# EAGLE schematic System Diagram (EAGLE 8.3.2)
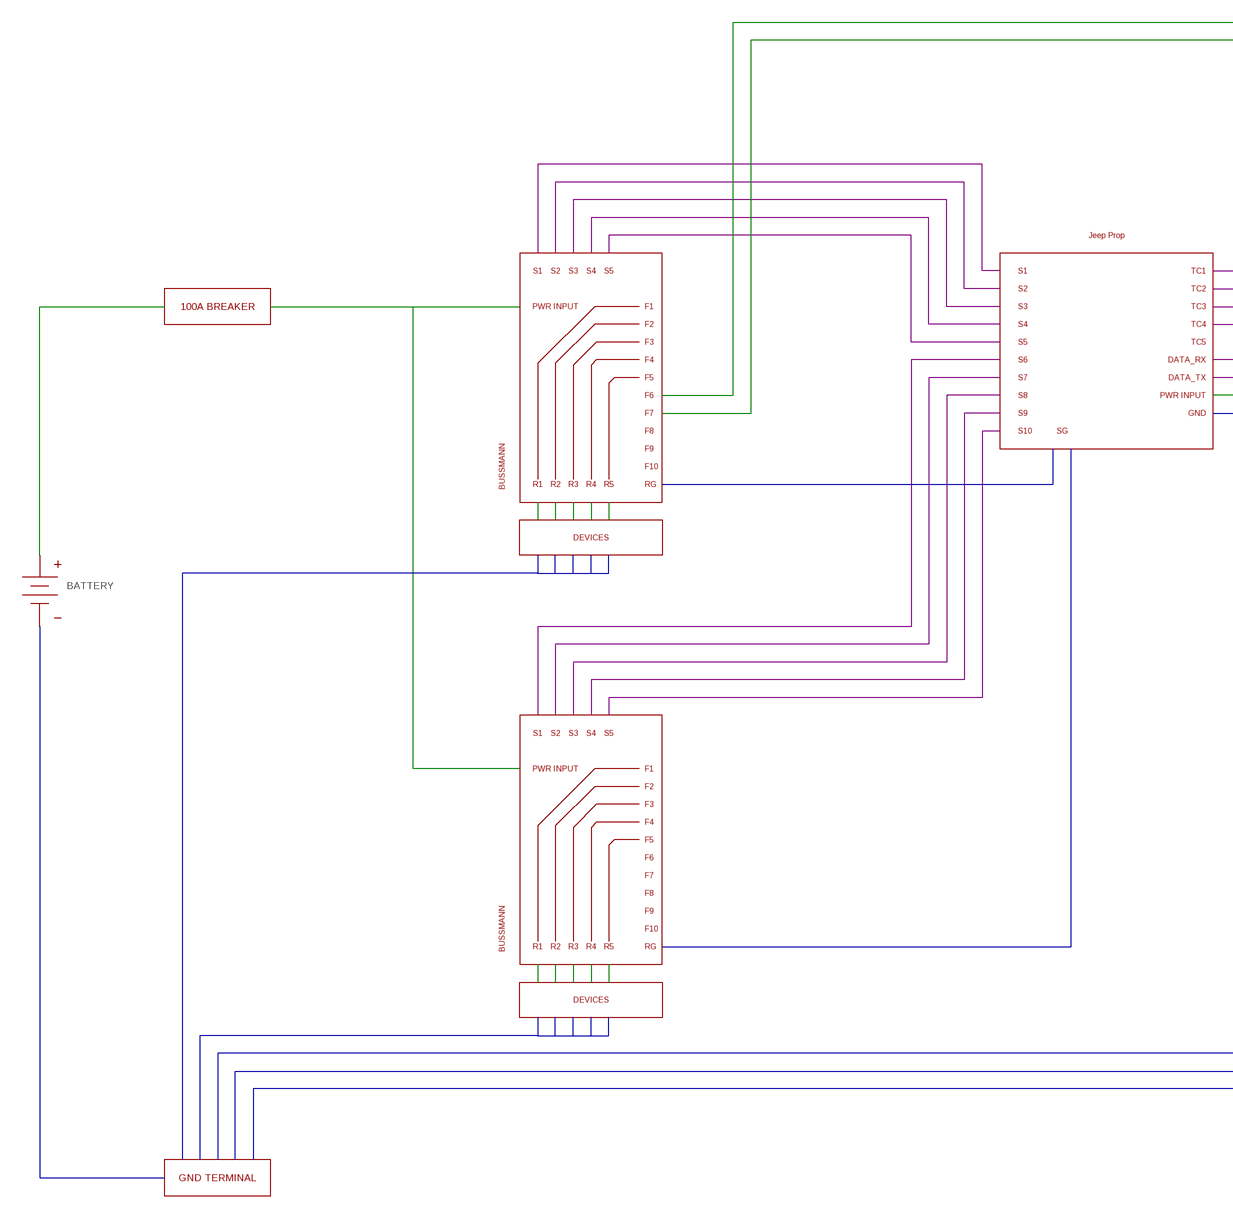
[diagram p0: schematic, sheet 1, part 1 of 2]
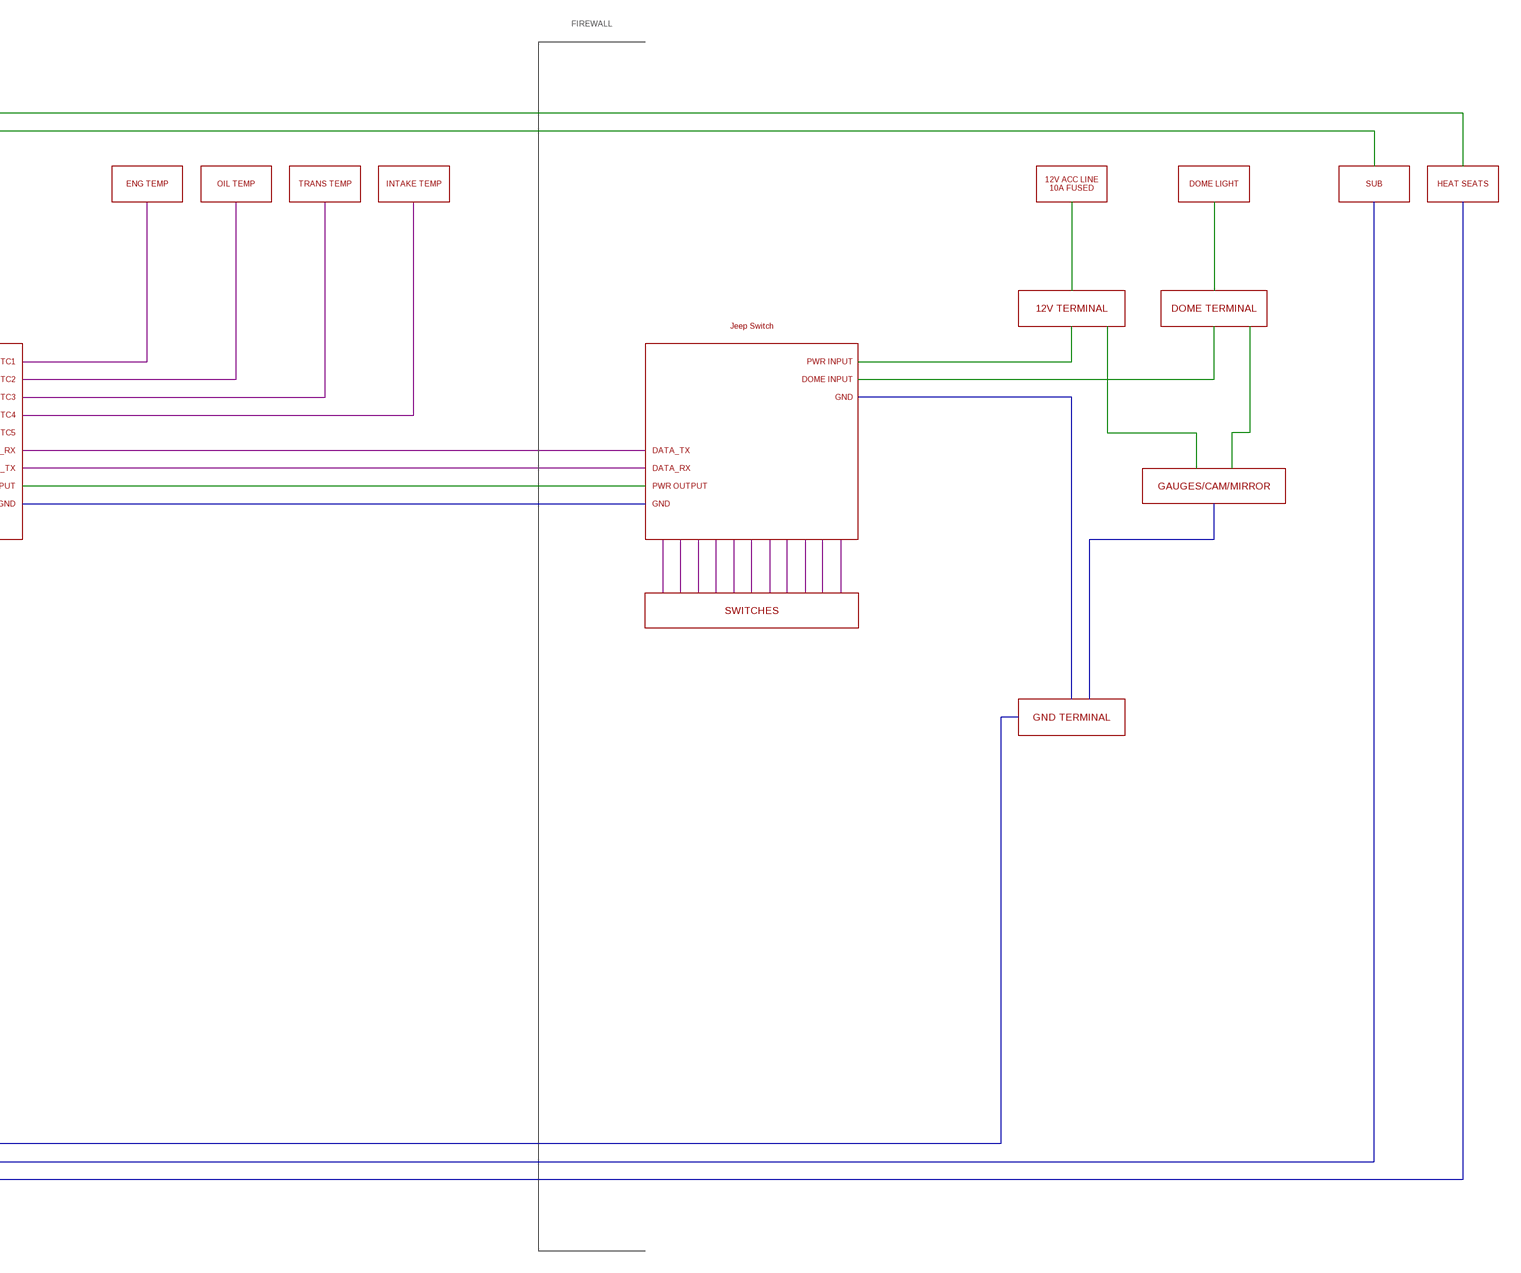
[diagram p1: schematic, sheet 1, part 2 of 2]

## Parts
BATTERY  BATTERY_BAT-HLD-001  [BAT-HLD-001]

## Nets
N$1: BATTERY.POS_0(POS) BATTERY.POS_1(POS)
Unconnected: BATTERY.NEG_0(NEG)

## Buses
B$1
B$2
B$3
B$4
B$5
B$6
B$7
B$8
B$9

## Notes on the sheet
- FIREWALL
- ENG TEMP | OIL TEMP | TRANS TEMP | INTAKE TEMP
- 12V ACC LINE
  10A FUSED
- DOME LIGHT | SUB | HEAT SEATS
- 12V TERMINAL | DOME TERMINAL
- Jeep Prop | Jeep Switch
- S1 | S2 | S3 | S4 | S5 | S1 | TC1 | PWR INPUT
- S2 | TC2 | DOME INPUT
- 100A BREAKER | PWR INPUT | F1 | S3 | TC3 | GND
- F2 | S4 | TC4
- F3 | S5 | TC5
- F4 | S6 | DATA_RX | DATA_TX
- F5 | S7 | DATA_TX | DATA_RX
- F6 | S8 | PWR INPUT | PWR OUTPUT | GAUGES/CAM/MIRROR
- F7 | S9 | GND | GND
- F8 | S10 | SG
- F9
- BUSSMANN | F10
- R1 | R2 | R3 | R4 | R5 | RG
- SWITCHES
- DEVICES
- GND TERMINAL
- S1 | S2 | S3 | S4 | S5
- PWR INPUT | F1
- F2
- F3
- F4
- F5
- F6
- F7
- F8
- F9
- BUSSMANN | F10
- R1 | R2 | R3 | R4 | R5 | RG
- DEVICES
- GND TERMINAL

## Library data of the parts
BATTERY = MF_Connectors:BATTERY: Library: MF_Connectors Description: Batterys and Battery Connectors.; HOUSEPART: NO; MPN: BAT-HLD-001; POPULATE: 1; URL: http://www.mouser.com/ds/2/238/bat-hld-001-220194.pdf; VALUE: BAT-HLD-001